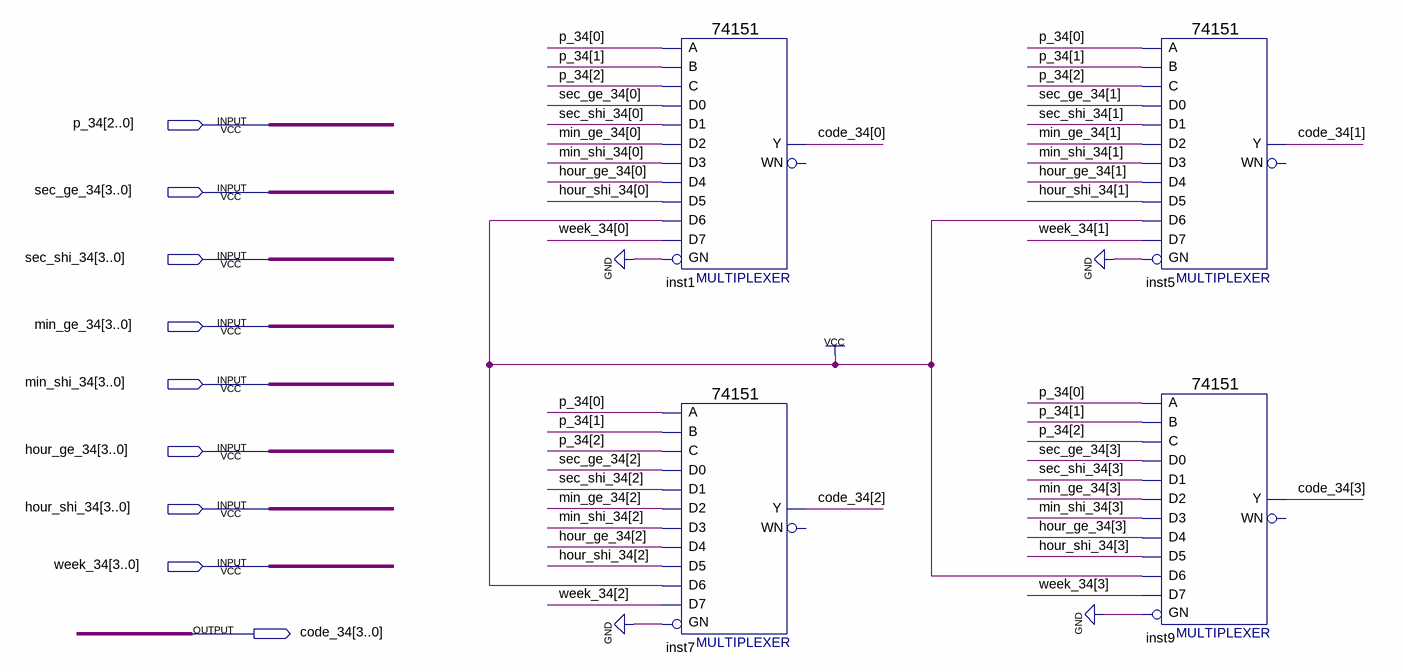
[diagram p0: schematic sheet]
// Quartus schematic code_select.bdf as structural Verilog: 4 symbols, 9 pins
module code_select (
  input  [2:0] p_34,
  input  [3:0] sec_ge_34,
  input  [3:0] sec_shi_34,
  input  [3:0] min_ge_34,
  input  [3:0] min_shi_34,
  input  [3:0] hour_ge_34,
  input  [3:0] hour_shi_34,
  input  [3:0] week_34,
  output [3:0] code_34
);

  \74151  inst1 (
    .GN(1'b0), .C(p_34[2]), .B(p_34[1]), .A(p_34[0]), .D5(hour_shi_34[0]), .D0(sec_ge_34[0]),
    .D1(sec_shi_34[0]), .D4(hour_ge_34[0]), .D3(min_shi_34[0]), .D2(min_ge_34[0]), .D6(1'b1),
    .D7(week_34[0]), .Y(code_34[0]));  // open: WN
  \74151  inst7 (
    .GN(1'b0), .C(p_34[2]), .B(p_34[1]), .A(p_34[0]), .D5(hour_shi_34[2]), .D0(sec_ge_34[2]),
    .D1(sec_shi_34[2]), .D4(hour_ge_34[2]), .D3(min_shi_34[2]), .D2(min_ge_34[2]), .D6(1'b1),
    .D7(week_34[2]), .Y(code_34[2]));  // open: WN
  \74151  inst5 (
    .GN(1'b0), .C(p_34[2]), .B(p_34[1]), .A(p_34[0]), .D5(hour_shi_34[1]), .D0(sec_ge_34[1]),
    .D1(sec_shi_34[1]), .D4(hour_ge_34[1]), .D3(min_shi_34[1]), .D2(min_ge_34[1]), .D6(1'b1),
    .D7(week_34[1]), .Y(code_34[1]));  // open: WN
  \74151  inst9 (
    .GN(1'b0), .C(p_34[2]), .B(p_34[1]), .A(p_34[0]), .D5(hour_shi_34[3]), .D0(sec_ge_34[3]),
    .D1(sec_shi_34[3]), .D4(hour_ge_34[3]), .D3(min_shi_34[3]), .D2(min_ge_34[3]), .D6(1'b1),
    .D7(week_34[3]), .Y(code_34[3]));  // open: WN
endmodule
